# Altium project Electron.PrjPCB
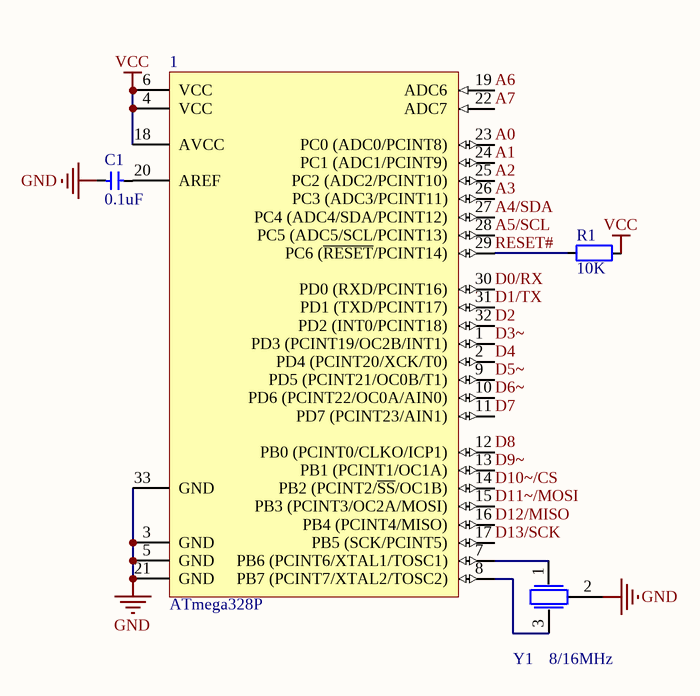
[diagram p0: Electron.SchDoc]
1 sheet, 4 parts. Net scope: global (net labels, ports and power ports of the same name join across sheets).
Board file: Electron.PcbDoc

## Sheet Electron.SchDoc
size 127 x 177 mm

### Parts
1  ATmega328P  [QFN-32]
C1  0.1uF  [CAP_0402]
R1  10K  [RES_0402]
Y1  8/16MHz  [晶振-3P]

### Nets
GND: 1.3(GND) 1.5(GND) 1.21(GND) 1.33(GND) C1.2 Y1.2
VCC: 1.4(VCC) 1.6(VCC) 1.18(AVCC) R1.2
A0: 1.23(PC0_(ADC0/PCINT8))
A1: 1.24(PC1_(ADC1/PCINT9))
A2: 1.25(PC2_(ADC2/PCINT10))
A3: 1.26(PC3_(ADC3/PCINT11))
A4/SDA: 1.27(PC4_(ADC4/SDA/PCINT12))
A5/SCL: 1.28(PC5_(ADC5/SCL/PCINT13))
A6: 1.19(ADC6)
A7: 1.22(ADC7)
D0/RX: 1.30(PD0_(RXD/PCINT16))
D1/TX: 1.31(PD1_(TXD/PCINT17))
D2: 1.32(PD2_(INT0/PCINT18))
D3~: 1.1(PD3_(PCINT19/OC2B/INT1))
D4: 1.2(PD4_(PCINT20/XCK/T0))
D5~: 1.9(PD5_(PCINT21/OC0B/T1))
D6~: 1.10(PD6_(PCINT22/OC0A/AIN0))
D7: 1.11(PD7_(PCINT23/AIN1))
D8: 1.12(PB0_(PCINT0/CLKO/ICP1))
D9~: 1.13(PB1_(PCINT1/OC1A))
D10~/CS: 1.14(PB2_(PCINT2/~{SS}/OC1B))
D11~/MOSI: 1.15(PB3_(PCINT3/OC2A/MOSI))
D12/MISO: 1.16(PB4_(PCINT4/MISO))
D13/SCK: 1.17(PB5_(SCK/PCINT5))
RESET#: 1.29(PC6_(~{RESET}/PCINT14)) R1.1
Net1_7: 1.7(PB6_(PCINT6/XTAL1/TOSC1)) Y1.1
Net1_8: 1.8(PB7_(PCINT7/XTAL2/TOSC2)) Y1.3
Net1_20: 1.20(AREF) C1.1

### Library data of the parts
1 = ATmega328P: MCU
C1 = 电容-0402: Capacitor; Value: 0.1u
R1 = 电阻-0402: Resistor; Value: 22R
Y1 = 晶振-3Pin: 村田贴片